# Altium project mSAS_BNC_fanout.PrjPCB
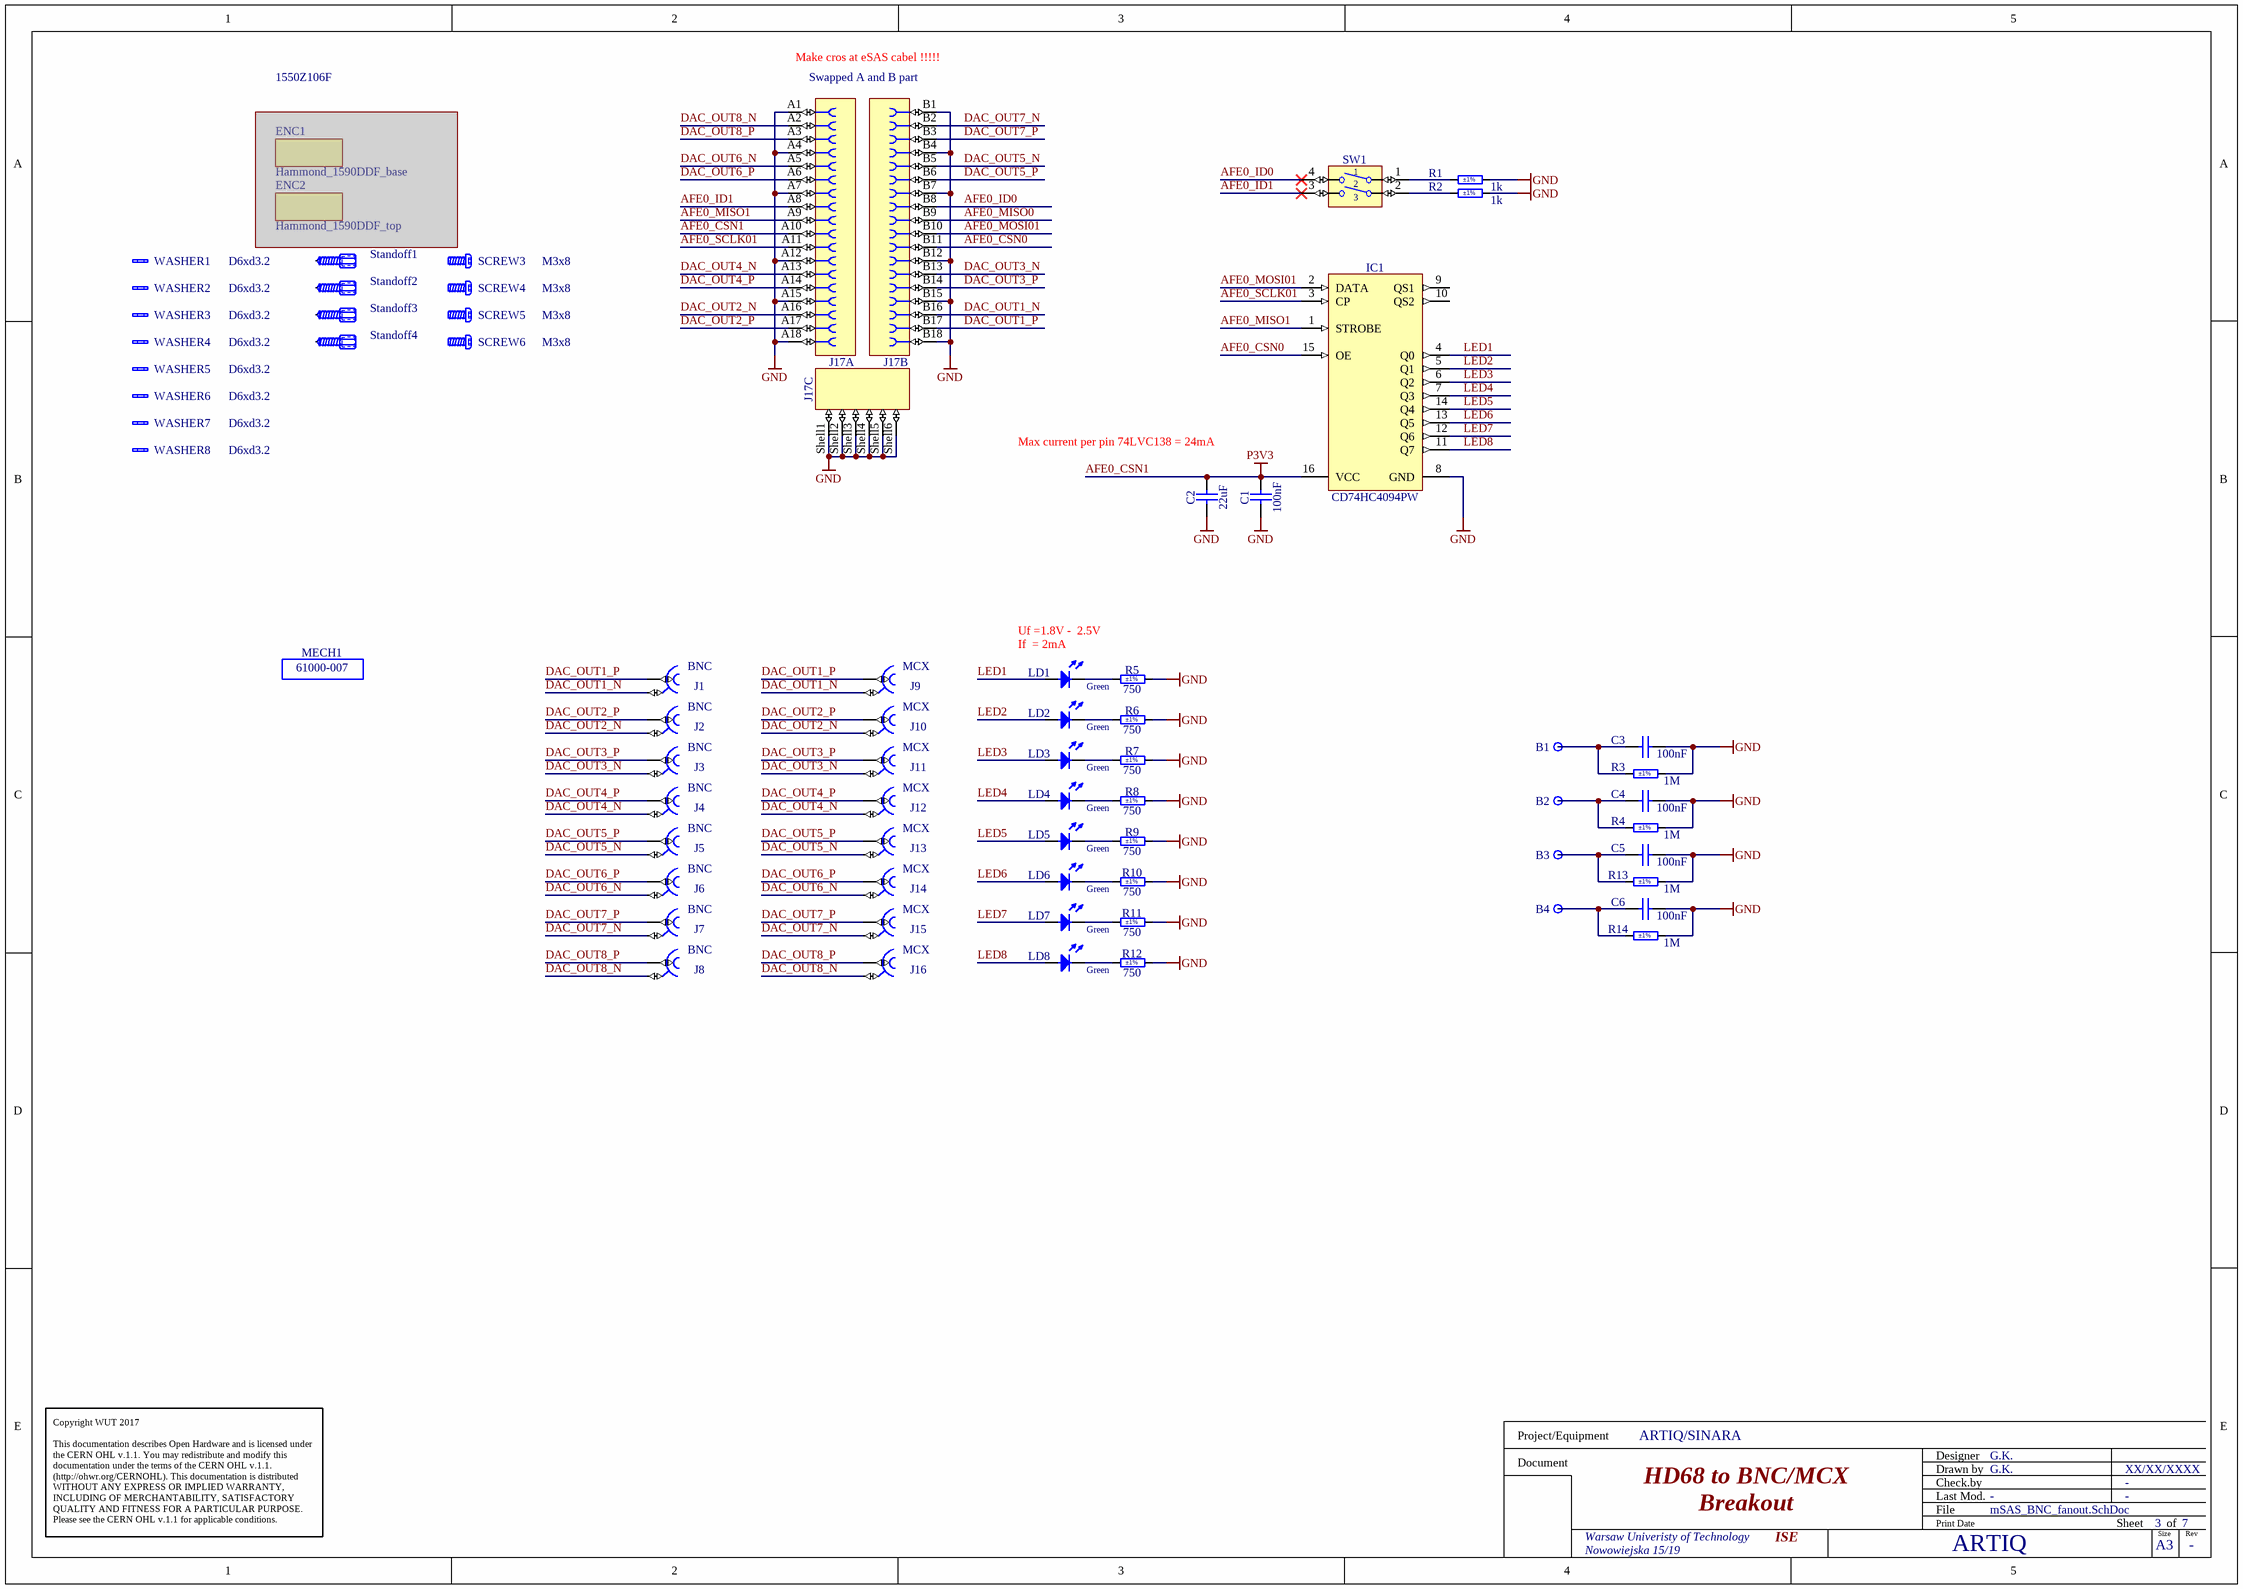
[diagram p0: mSAS_BNC_fanout.SchDoc]
1 sheet, 70 parts. Net scope: global (net labels, ports and power ports of the same name join across sheets).
Board files: mSAS_BNC_fanout.PCBDOC, Panel_eSAS_BNC_fanout.PcbDoc

## Sheet mSAS_BNC_fanout.SchDoc: HD68 to BNC/MCX
size 420 x 297 mm; Author: G.K.; CompanyName: WUT; DrawnBy: G.K.; Organization: WUT ISE; Address1: Warsaw Univeristy of Technology; Address2: Nowowiejska 15/19; DocumentNumber: 3; Revision: -; SheetNumber: 3; SheetTotal: 7; EDA_Number: ARTIQ; Projet: ARTIQ/SINARA; ModifiedBy: -; CreateDate: XX/XX/XXXX; CheckedDate: -; Title2: Breakout; DivGrp: ISE; Designer: G.K.; ModifiedDate: -; ProjectName: IDC to HD68 adapter

### Parts
B1  Plated Hole  [MTG270_500]  (value not drawn)  (no BOM)
B2  Plated Hole  [MTG270_500]  (value not drawn)  (no BOM)
B3  Plated Hole  [MTG270_500]  (value not drawn)  (no BOM)
B4  Plated Hole  [MTG270_500]  (value not drawn)  (no BOM)
C1  100nF  [CAPC1608X87N]
C2  22uF  [CAPC1608X90N]
C3  100nF  [CAPC1608X90N]
C4  100nF  [CAPC1608X90N]
C5  100nF  [CAPC1608X90N]
C6  100nF  [CAPC1608X90N]
ENC1  Hammond_1590DDF_base  [1590DDF_base]  (masked out: inside a compile mask, not in the netlist)
ENC2  Hammond_1590DDF_top  [1590D-DD-E_LID_custom]  (masked out: inside a compile mask, not in the netlist)
IC1  CD74HC4094PW  [SOP65P640X120-16N]
J1  BNC  [TYCO_5-1634506-1]
J2  BNC  [TYCO_5-1634506-1]
J3  BNC  [TYCO_5-1634506-1]
J4  BNC  [TYCO_5-1634506-1]
J5  BNC  [TYCO_5-1634506-1]
J6  BNC  [TYCO_5-1634506-1]
J7  BNC  [TYCO_5-1634506-1]
J8  BNC  [TYCO_5-1634506-1]
J9  MCX  [AMPHENOL_919-109J-51PX]
J10  MCX  [AMPHENOL_919-109J-51PX]
J11  MCX  [AMPHENOL_919-109J-51PX]
J12  MCX  [AMPHENOL_919-109J-51PX]
J13  MCX  [AMPHENOL_919-109J-51PX]
J14  MCX  [AMPHENOL_919-109J-51PX]
J15  MCX  [AMPHENOL_919-109J-51PX]
J16  MCX  [AMPHENOL_919-109J-51PX]
J17  iPass™  [MOLEX_75783-0107]  (value not drawn)  (parts A,B,C of 3)
LD1  Green  [LED_KINGBRIGHT_KP-1608CGCK]
LD2  Green  [LED_KINGBRIGHT_KP-1608CGCK]
LD3  Green  [LED_KINGBRIGHT_KP-1608CGCK]
LD4  Green  [LED_KINGBRIGHT_KP-1608CGCK]
LD5  Green  [LED_KINGBRIGHT_KP-1608CGCK]
LD6  Green  [LED_KINGBRIGHT_KP-1608CGCK]
LD7  Green  [LED_KINGBRIGHT_KP-1608CGCK]
LD8  Green  [LED_KINGBRIGHT_KP-1608CGCK]
MECH1  61000-007  [GENERIC_MECH]
R1  1k  Tolerance: ±1%  [RESC1608X55N]
R2  1k  Tolerance: ±1%  [RESC1608X55N]
R3  1M  Tolerance: ±1%  [RESC1608X55N]
R4  1M  Tolerance: ±1%  [RESC1608X55N]
R5  750  Tolerance: ±1%  [RESC1608X55N]
R6  750  Tolerance: ±1%  [RESC1608X55N]
R7  750  Tolerance: ±1%  [RESC1608X55N]
R8  750  Tolerance: ±1%  [RESC1608X55N]
R9  750  Tolerance: ±1%  [RESC1608X55N]
R10  750  Tolerance: ±1%  [RESC1608X55N]
R11  750  Tolerance: ±1%  [RESC1608X55N]
R12  750  Tolerance: ±1%  [RESC1608X55N]
R13  1M  Tolerance: ±1%  [RESC1608X55N]
R14  1M  Tolerance: ±1%  [RESC1608X55N]
SCREW3  M3x8  [BOSSARD_BN5687-3061606_h]
SCREW4  M3x8  [BOSSARD_BN5687-3061606_h]
SCREW5  M3x8  [BOSSARD_BN5687-3061606_h]
SCREW6  M3x8  [BOSSARD_BN5687-3061606_h]
Standoff1  (no value)  [ETTINGER_005.13.103]
Standoff2  (no value)  [ETTINGER_005.13.103]
Standoff3  (no value)  [ETTINGER_005.13.103]
Standoff4  (no value)  [ETTINGER_005.13.103]
SW1  Switch  [SW_OMRON_A6DR-2101]  (value not drawn)
WASHER1  D6xd3.2  [BOSSARD_BN83728-8243964_v]
WASHER2  D6xd3.2  [BOSSARD_BN83728-8243964_v]
WASHER3  D6xd3.2  [BOSSARD_BN83728-8243964_v]
WASHER4  D6xd3.2  [BOSSARD_BN83728-8243964_v]
WASHER5  D6xd3.2  [BOSSARD_BN83728-8243964_v]
WASHER6  D6xd3.2  [BOSSARD_BN83728-8243964_v]
WASHER7  D6xd3.2  [BOSSARD_BN83728-8243964_v]
WASHER8  D6xd3.2  [BOSSARD_BN83728-8243964_v]

### Nets
AFE0_CSN1: C1.2 C2.2 IC1.16(VCC) J17.A10  [also labelled P3V3]
GND: C1.1 C2.1 C3.2 C4.2 C5.2 C6.2 IC1.8(GND) J17.A1 J17.A4 J17.A7 J17.A12 J17.A15 J17.A18 J17.B1 J17.B4 J17.B7 J17.B12 J17.B15 J17.B18 J17.Shell1 J17.Shell2 J17.Shell3 J17.Shell4 J17.Shell5 J17.Shell6 R1.2 R2.2 R3.2 R4.2 R5.2 R6.2 R7.2 R8.2 R9.2 R10.2 R11.2 R12.2 R13.2 R14.2
AFE0_CSN0: IC1.15(OE) J17.B11
AFE0_ID0: J17.B8 SW1.4
AFE0_ID1: J17.A8 SW1.3
AFE0_MISO0: J17.B9
AFE0_MISO1: IC1.1(STROBE) J17.A9
AFE0_MOSI01: IC1.2(DATA) J17.B10
AFE0_SCLK01: IC1.3(CP) J17.A11
DAC_OUT1_N: J1.2 J9.2 J17.B16
DAC_OUT1_P: J1.1 J9.1 J17.B17
DAC_OUT2_N: J2.2 J10.2 J17.A16
DAC_OUT2_P: J2.1 J10.1 J17.A17
DAC_OUT3_N: J3.2 J11.2 J17.B13
DAC_OUT3_P: J3.1 J11.1 J17.B14
DAC_OUT4_N: J4.2 J12.2 J17.A13
DAC_OUT4_P: J4.1 J12.1 J17.A14
DAC_OUT5_N: J5.2 J13.2 J17.B5
DAC_OUT5_P: J5.1 J13.1 J17.B6
DAC_OUT6_N: J6.2 J14.2 J17.A5
DAC_OUT6_P: J6.1 J14.1 J17.A6
DAC_OUT7_N: J7.2 J15.2 J17.B2
DAC_OUT7_P: J7.1 J15.1 J17.B3
DAC_OUT8_N: J8.2 J16.2 J17.A2
DAC_OUT8_P: J8.1 J16.1 J17.A3
LED1: IC1.4(Q0) LD1.2(A)
LED2: IC1.5(Q1) LD2.2(A)
LED3: IC1.6(Q2) LD3.2(A)
LED4: IC1.7(Q3) LD4.2(A)
LED5: IC1.14(Q4) LD5.2(A)
LED6: IC1.13(Q5) LD6.2(A)
LED7: IC1.12(Q6) LD7.2(A)
LED8: IC1.11(Q7) LD8.2(A)
NetB1_1: B1.1 C3.1 R3.1
NetB2_1: B2.1 C4.1 R4.1
NetB3_1: B3.1 C5.1 R13.1
NetB4_1: B4.1 C6.1 R14.1
NetLD1_1: LD1.1(C) R5.1
NetLD2_1: LD2.1(C) R6.1
NetLD3_1: LD3.1(C) R7.1
NetLD4_1: LD4.1(C) R8.1
NetLD5_1: LD5.1(C) R9.1
NetLD6_1: LD6.1(C) R10.1
NetLD7_1: LD7.1(C) R11.1
NetLD8_1: LD8.1(C) R12.1
NetR1_1: R1.1 SW1.1
NetR2_1: R2.1 SW1.2

Not connected (* = marked no-connect by the designer): IC1 9(QS1) 10(QS2); Standoff1 1; Standoff2 1; Standoff3 1; Standoff4 1

### Notes on the sheet
- 1550Z106F
- (near J17) Make cros at eSAS cabel !!!!!
- (near J17) Swapped A and B part
- Max current per pin 74LVC138 = 24mA
- Uf =1.8V -  2.5V
- (near LD1) If  = 2mA
- Copyright WUT 2017
  This documentation describes Open Hardware and is licensed under the CERN OHL v.1.1. You may redistribute and modify this documentation under the terms of the CERN OHL v.1.1. (http://ohwr.org/CERNOHL). This documentation is distributed WITHOUT ANY EXPRESS OR IMPLIED WARRANTY, INCLUDING OF MERCHANTABILITY, SATISFACTORY QUALITY AND FITNESS FOR A PARTICULAR PURPOSE. Please see the CERN OHL v.1.1 for applicable conditions.
- Project/Equipment
- Document
- Designer
- Drawn by
- Check.by
- File
- Last Mod.
- Print Date
- Sheet
- Size
- A3
- of
- Rev

### Library data of the parts
B1-B4 = PLATED_HOLE2.7_PAD5.0: Single Terminal Socket; Part Description: Plated Through Hole: Hole Dia.=2.7mm Pad Dia.=5.0mm; Mounted: No; Part Number: PLATED_HOLE2.7_PAD5.0; Component Type: Standard (No BOM); Pin Count: 1; Family: Plated Hole; Socket: No; SMD: No; Sense: No; Status: None; ComponentHeight: 0mm; HelpURL: Undefined; Author: CERN DEM JMW; CreateDate: 27.09.2011; LatestRevisionDate: 27.09.2011; PackageDescription: Plated Through Hole: Hole Dia.=2.7mm Pad Dia.=5.0mm
C1 = CC0603_100NF_50V_10%_X7R: Non-polarised capacitor; Part Description: SMD Multilayer Chip Ceramic Capacitor; Manufacturer: GENERIC; Manufacturer1 Part Number: 223858615649; Voltage: 50V; TC: X7R; Tolerance: ±10%; Part Number: CC0603_100NF_50V_10%_X7R; Component Kind: Standard; Component Type: Standard; Pin Count: 2; Value: 100nF; Status: Preferred; Manufacturer Part Number: CC0603_100NF_50V_10%_X7R; Case: 0603; Mounted: Yes; Socket: No; SMD: Yes; Sense: No; Manufacturer1 Example: PHYCOMP; Manufacturer1 ComponentHeight: 0.87mm; HelpURL: \\cern.ch\dfs\Applications\Altium\Datasheets\CC0603_X7R_PHYCOMP.pdf; Author: CERN DEM JLC; CreateDate: 03.12.2007; LatestRevisionDate: 03.12.2007
C2 = CC0603_22UF_10V_20%_X5R: Non-polarised capacitor; Part Description: SMD Multilayer Chip Ceramic Capacitor; Manufacturer: GENERIC; Manufacturer1 Part Number: C1608X5R1A226M080; Voltage: 10V; TC: X5R; Tolerance: ±20%; Part Number: CC0603_22UF_10V_20%_X5R; Component Kind: Standard; Component Type: Standard; Pin Count: 2; Value: 22uF; Status: None; Manufacturer Part Number: CC0603_22UF_10V_20%_X5R; Case: 0603; Mounted: Yes; Socket: No; SMD: Yes; Sense: No; Manufacturer1 Example: TDK; Manufacturer1 ComponentHeight: 0.9mm; HelpURL: \\cern.ch\dfs\Applications\Altium\Datasheets\CC0603_X5R_TDK_C.pdf; Author: CERN DEM BC; CreateDate: 03.12.2020; LatestRevisionDate: 03.12.2020
C3-C6 = CC0603_100NF_100V_10%_X7R: Non-polarised capacitor; Part Description: SMD Multilayer Chip Ceramic Capacitor; Manufacturer: GENERIC; Manufacturer1 Part Number: GRM188R72A104KA35D; Voltage: 100V; TC: X7R; Tolerance: ±10%; Part Number: CC0603_100NF_100V_10%_X7R; Component Kind: Standard; Component Type: Standard; Pin Count: 2; Value: 100nF; Status: None; Manufacturer Part Number: CC0603_100NF_100V_10%_X7R; Case: 0603; Mounted: Yes; Socket: No; SMD: Yes; Sense: No; Manufacturer1 Example: MURATA; Manufacturer1 ComponentHeight: 0.9mm; HelpURL: \\cern.ch\dfs\Applications\Altium\Datasheets\CC0603_MURATA_GRM188R72A104KA35D.pdf; Author: CERN DEM JLC; CreateDate: 11.12.2013; LatestRevisionDate: 11.12.2013
ENC1 = Hammond_1590DDF_base: Hammond 1590DDF enclosure base part
ENC2 = Hammond_1590DDF_top_custom: Hammond 1590DDF enclosure lid with custom cutouts
IC1 = CD74HC4094PW: High−Speed CMOS Logic, 8−Stage Shift and Store Bus Register, Three−State; Manufacturer: TEXAS INSTRUMENTS; PressFit: No; Bonding: No; Part Number: CD74HC4094PW; Component Kind: Standard; Component Type: Standard; Device: CD74HC4094PW; PackageDescription: SOP, 0.65mm Pitch; 16 Pin, 4.40mm W X 5.00mm L X 1.20mm H body, IPC Medium Density; Part Description: High−Speed CMOS Logic, 8−Stage Shift and Store Bus Register, Three−State; Manufacturer Part Number: CD74HC4094PW; Pin Count: 16; Case: TSSOP16; Mounted: Yes; Socket: No; SMD: Yes; Sense: No; ComponentHeight: 1.2mm; Author: CERN DEM MR; HelpURL: \\cern.ch\dfs\Applications\Altium\Datasheets\CD74HC4094PW.pdf; CreateDate: 08.03.2016; LatestRevisionDate: 08.03.2016
J1-J8 = TYCO_5-1634506-1: Part Description: 50 Ohms BNC PCB Straight Socket; Manufacturer: TYCO ELECTRONICS; PressFit: No; Part Number: TYCO_5-1634506-1; Component Kind: Standard; Component Type: Standard; Pin Count: 2; Family: BNC; Mounted: Yes; Socket: No; SMD: No; Sense: No; Status: None; Manufacturer Part Number: 5-1634506-1; ComponentHeight: 16.7mm; HelpURL: \\cern.ch\dfs\Applications\Altium\Datasheets\TYCO_5-1634506-1.pdf; Author: CERN DEM JLC; CreateDate: 14.02.2011; LatestRevisionDate: 14.02.2011
J9-J16 = AMPHENOL_919-109J-51PX: Part Description: 50 Ohm, RF Connector, MCX Straight PCB Receptacle Jack; Manufacturer Part Number: 919-109J-51PX (MCX6251B1-3GT30G-50); PressFit: No; Part Number: AMPHENOL_919-109J-51PX; Component Kind: Standard; Component Type: Standard; Pin Count: 5; Family: MCX; Mounted: Yes; Socket: No; SMD: No; Sense: No; Status: None; Manufacturer: AMPHENOL; ComponentHeight: 6.06mm; HelpURL: \\cern.ch\dfs\Applications\Altium\Datasheets\AMPHENOL_919-109J-51PX.pdf; Author: CERN DEM BC; CreateDate: 31.01.2019; LatestRevisionDate: 31.01.2019
J17 = MOLEX_75783-0107: 36 Circuit, Right Angle , Internal Assembly, iPass™ I/O Surface Mount Receptacle with Left Key Shell; Part Number: MOLEX 75783-0107 / 75783-0136; Manufacturer: MOLEX; Manufacturer Part Number: 75783-0107 / 75783-0136; PressFit: No; Component Kind: Standard; Component Type: Standard; Pin Count: 42; Family: iPass™; Mounted: Yes; Socket: No; SMD: Yes; Sense: No; Status: None; Part Description: 36 Circuit, Right Angle , Internal Assembly, iPass™ I/O Surface Mount Receptacle with Left Key Shell; ComponentHeight: 8.47mm; HelpURL: \\cern.ch\dfs\Applications\Altium\Datasheets\MOLEX_75783-0107.pdf; Author: CERN DEM JLC; CreateDate: 12.11.2014; LatestRevisionDate: 12.11.2014
LD1-LD8 = LED_KINGBRIGHT_KP-1608CGCK: LED Green 1C 2A; Part Description: 1.6x0.8mm SMD Chip Green LED Lamp; PressFit: No; Bonding: No; Part Number: LED_KINGBRIGHT_KP-1608CGCK; Component Kind: Standard; Component Type: Standard; Color: Green; PackageDescription: SMT Green LED, Case 0603, Body L 1.60mm x W 0.80mm x H 1.10mm; Manufacturer: KINGBRIGHT; Manufacturer Part Number: KP-1608CGCK; Pin Count: 2; Case: 0603; Mounted: Yes; Socket: No; SMD: Yes; Sense: No; ComponentHeight: 1.1mm; HelpURL: \\cern.ch\dfs\Applications\Altium\Datasheets\LED_KINGBRIGHT_KP-1608CGCK.pdf; Author: CERN DEM HF; CreateDate: 01.10.2021; LatestRevisionDate: 01.10.2021
MECH1 = Generic_mechanical: PCB Solder Side Cover, 3 U, 100 mm x 160 mm, 55°C Schroff insulating plate; PressFit: No; Part Number: 61000-007; Component Kind: Accessories; Component Type: Standard; Footprint: generic_MECH; Pin Count: 0; PackageDescription: generic; Mounted: Yes; Socket: No; SMD: No; Sense: No; Status: None; Value: 61000-007; Part Description: PCB Solder Side Cover, 3 U, 100 mm x 160 mm, 55°C Schroff insulating plate; Manufacturer: Schroff; Manufacturer Part Number: 61000-007; ComponentHeight: generic; Author: GK; CreateDate: 28.10.2019; LatestRevisionDate: 28.10.2019
R1 R2 = R0603_1K_1%_0.1W_100PPM: Resistor - 1%; Part Description: General Purpose Thick Film Chip Resistor; Manufacturer: GENERIC; Manufacturer1 Part Number: NRC06F1001TRF; Power: 0.1W; TC: ±100ppm/°C; PressFit: No; Part Number: R0603_1K_1%_0.1W_100PPM; Component Kind: Standard; Component Type: Standard; Pin Count: 2; Value: 1k; Status: Preferred; Manufacturer Part Number: R0603_1K_1%_0.1W_100PPM; Case: 0603; Mounted: Yes; Sense: No; Socket: No; SMD: Yes; Manufacturer1 Example: NIC COMPONENT; Manufacturer1 ComponentHeight: 0.55mm; HelpURL: \\cern.ch\dfs\Applications\Altium\Datasheets\R0603_NIC_NRC.pdf; Author: CERN DEM JLC; CreateDate: 03.12.2007; LatestRevisionDate: 13.03.2008
R3 R4 R13 R14 = R0603_1M_1%_0.1W_100PPM: Resistor - 1%; Part Description: General Purpose Thick Film Chip Resistor; Manufacturer: GENERIC; Manufacturer1 Part Number: NRC06F1004TRF; Power: 0.1W; TC: ±100ppm/°C; PressFit: No; Part Number: R0603_1M_1%_0.1W_100PPM; Component Kind: Standard; Component Type: Standard; Pin Count: 2; Value: 1M; Status: Preferred; Manufacturer Part Number: R0603_1M_1%_0.1W_100PPM; Case: 0603; Mounted: Yes; Sense: No; Socket: No; SMD: Yes; Manufacturer1 Example: NIC COMPONENT; Manufacturer1 ComponentHeight: 0.55mm; HelpURL: \\cern.ch\dfs\Applications\Altium\Datasheets\R0603_NIC_NRC.pdf; Author: CERN DEM JLC; CreateDate: 03.12.2007; LatestRevisionDate: 13.03.2008
R5-R12 = R0603_750R_1%_0.1W_100PPM: Resistor - 1%; Part Description: General Purpose Thick Film Chip Resistor; Manufacturer: GENERIC; Manufacturer1 Part Number: NRC06F7500TRF; Power: 0.1W; TC: ±100ppm/°C; PressFit: No; Part Number: R0603_750R_1%_0.1W_100PPM; Component Kind: Standard; Component Type: Standard; Pin Count: 2; Value: 750; Status: Preferred; Manufacturer Part Number: R0603_750R_1%_0.1W_100PPM; Case: 0603; Mounted: Yes; Sense: No; Socket: No; SMD: Yes; Manufacturer1 Example: NIC COMPONENT; Manufacturer1 ComponentHeight: 0.55mm; HelpURL: \\cern.ch\dfs\Applications\Altium\Datasheets\R0603_NIC_NRC.pdf; Author: CERN DEM JLC; CreateDate: 03.12.2007; LatestRevisionDate: 13.03.2008
SCREW3-SCREW6 = BOSSARD_BN5687-3061606_h: Screw; Part Description: M3 L=8mm Hexalobular Socket Pan Head Screw, Fully Threaded, Stainless Steel A2; Manufacturer Part Number: BN5687 Art.3061606; PressFit: No; Part Number: BOSSARD_BN5687-3061606_h; Component Kind: Standard; Component Type: Mechanical; Pin Count: 0; PackageDescription: M3 L=8mm Hexalobular Socket Pan Head Screw, Fully Threaded - Stainless Steel A2; Mounted: Yes; Socket: No; SMD: No; Sense: No; Status: None; Value: M3x8; Manufacturer: BOSSARD; ComponentHeight: 5.6mm; HelpURL: \\cern.ch\dfs\Applications\Altium\Datasheets\BOSSARD_BN5687-3061606.pdf; Author: CERN DEM JLC; CreateDate: 07.02.2013; LatestRevisionDate: 07.02.2013
Standoff1-Standoff4 = ETTINGER_005.13.103: Standoff Male-Female; Part Description: Standoff Nickel-Plated Brass M/F AF5.5x10 F=M3x6.5 M=M3x6; PressFit: No; Part Number: ETTINGER_005.13.103; Component Kind: Standard; Component Type: Mechanical; Pin Count: 1; PackageDescription: Standoff Nickel-Plated Brass M/F AF5.5x10 F=M3x6.5 M=M3x6; Mounted: Yes; Socket: No; SMD: No; Sense: No; Status: None; Manufacturer: ETTINGER; Manufacturer Part Number: 005.13.103; ComponentHeight: 10mm; HelpURL: \\cern.ch\dfs\Applications\Altium\Datasheets\ETTINGER_005.13.103.pdf; Author: CERN DEM HF; CreateDate: 17.05.2023; LatestRevisionDate: 17.05.2023
SW1 = SW_OMRON_A6DR-2101: 2 Ways SPST DIP Switch; Part Number: SW_OMRON_A6FR-2101; Part Description: 2 Ways SPST Sealed Piano DIP Switch, Contact Rating 25mA 24VDC; Manufacturer: OMRON; PressFit: No; Component Kind: Standard; Component Type: Standard; Footprint: SW_OMRON_A6FR-2101; Pin Count: 4; PackageDescription: Pitch 2.54mm, Body 6.64x9.9mm, 4 Ways SPST Sealed Piano DIP Switch, OMRON A6DR; Family: Switch; Mounted: Yes; Socket: No; SMD: No; Sense: No; Status: None; Manufacturer Part Number: A6DR-2101; ComponentHeight: 7.6mm; HelpURL: \\cern.ch\dfs\Applications\Altium\Datasheets\SW_OMRON_A6DR-4100.pdf
WASHER1-WASHER8 = BOSSARD_BN83728-8243964_v: Washer; Part Description: Waved Spring Washer for M3 Screw - Steel 440-520 HV - Zinc Plated Blue; Manufacturer Part Number: BN83728 Art.8243964; PressFit: No; Part Number: BOSSARD_BN83728-8243964_v; Component Kind: Standard; Component Type: Mechanical; Pin Count: 0; PackageDescription: Waved Spring Washer for M3 Screw, Steel 440-520 HV, Zinc Plated Blue; Mounted: Yes; Socket: No; SMD: No; Sense: No; Status: None; Value: D6xd3.2; Manufacturer: BOSSARD; ComponentHeight: 0.4mm; HelpURL: \\cern.ch\dfs\Applications\Altium\Datasheets\BOSSARD_BN83728-8243964.pdf; Author: CERN DEM JLC; CreateDate: 27.04.2017; LatestRevisionDate: 27.04.2017

## Assembly variants
MCX_3U: not fitted J2 J4 J6 J8 J10 J12 J14 J16
STD_BNC: not fitted MECH1